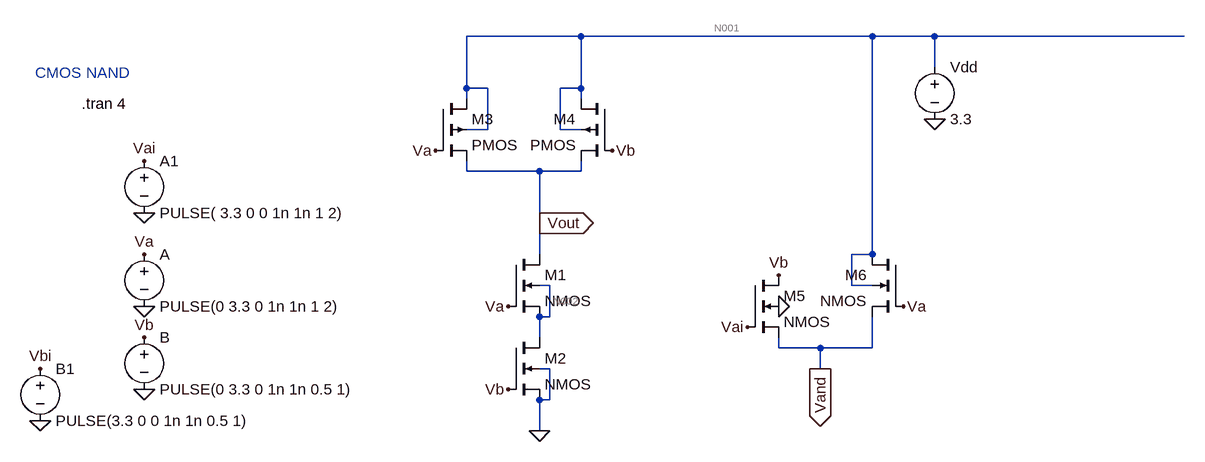
[diagram p0: schematic CMOS_NAND.asc]
CMOS_NAND.asc, the LTspice schematic file:
Version 4
SHEET 1 1540 680
WIRE 576 0 400 0
WIRE 1024 0 576 0
WIRE 1120 0 1024 0
WIRE 1504 0 1120 0
WIRE 1120 48 1120 0
WIRE 400 80 400 0
WIRE 432 80 400 80
WIRE 576 80 576 0
WIRE 576 80 544 80
WIRE 400 96 400 80
WIRE 576 96 576 80
WIRE 432 144 432 80
WIRE 432 144 400 144
WIRE 544 144 544 80
WIRE 576 144 544 144
WIRE 400 208 400 192
WIRE 512 208 400 208
WIRE 576 208 576 192
WIRE 576 208 512 208
WIRE 512 288 512 208
WIRE 512 336 512 288
WIRE 1024 336 1024 0
WIRE 1024 336 992 336
WIRE 528 384 512 384
WIRE 992 384 992 336
WIRE 1024 384 992 384
WIRE 528 432 528 384
WIRE 528 432 512 432
WIRE 512 464 512 432
WIRE 880 480 880 464
WIRE 944 480 880 480
WIRE 1024 480 1024 432
WIRE 1024 480 944 480
WIRE 528 512 512 512
WIRE 944 512 944 480
WIRE 528 560 528 512
WIRE 528 560 512 560
WIRE 512 608 512 560
FLAG -96 416 0
FLAG -96 544 0
FLAG 1120 128 0
FLAG 512 608 0
FLAG -96 336 Va
FLAG 352 176 Va
FLAG 464 416 Va
FLAG -96 464 Vb
FLAG 464 544 Vb
FLAG 624 176 Vb
FLAG 512 288 Vout
IOPIN 512 288 Out
FLAG 832 448 Vai
FLAG 880 368 Vb
FLAG 1072 416 Va
FLAG 944 512 Vand
IOPIN 944 512 Out
FLAG -96 272 0
FLAG -96 192 Vai
FLAG -256 592 0
FLAG -256 512 Vbi
FLAG 880 416 0
SYMBOL nmos4 464 336 R0
SYMATTR InstName M1
SYMBOL nmos4 464 464 R0
SYMATTR InstName M2
SYMBOL pmos4 352 96 R0
SYMATTR InstName M3
SYMBOL pmos4 624 96 M0
SYMATTR InstName M4
SYMBOL voltage -96 320 R0
WINDOW 123 0 0 Left 0
WINDOW 39 0 0 Left 0
SYMATTR InstName A
SYMATTR Value PULSE(0 3.3 0 1n 1n 1 2)
SYMBOL voltage -96 448 R0
SYMATTR InstName B
SYMATTR Value PULSE(0 3.3 0 1n 1n 0.5 1)
SYMBOL voltage 1120 32 R0
SYMATTR InstName Vdd
SYMATTR Value 3.3
SYMBOL voltage -96 176 R0
WINDOW 123 0 0 Left 0
WINDOW 39 0 0 Left 0
SYMATTR InstName A1
SYMATTR Value PULSE( 3.3 0 0 1n 1n 1 2)
SYMBOL voltage -256 496 R0
SYMATTR InstName B1
SYMATTR Value PULSE(3.3 0 0 1n 1n 0.5 1)
SYMBOL nmos4 832 368 R0
SYMATTR InstName M5
SYMBOL nmos4 1072 336 M0
SYMATTR InstName M6
TEXT -264 56 Left 2 ;CMOS NAND
TEXT -192 104 Left 2 !.tran 4

The netlist it stands for:
* CMOS_NAND.asc
M1 Vout Va N002 N002 NMOS
M2 N002 Vb 0 0 NMOS
M3 N001 Va Vout N001 PMOS
M4 N001 Vb Vout N001 PMOS
V§A Va 0 PULSE(0 3.3 0 1n 1n 1 2)
V§B Vb 0 PULSE(0 3.3 0 1n 1n 0.5 1)
Vdd N001 0 3.3
V§A1 Vai 0 PULSE( 3.3 0 0 1n 1n 1 2)
V§B1 Vbi 0 PULSE(3.3 0 0 1n 1n 0.5 1)
M5 Vb Vai Vand 0 NMOS
M6 N001 Va Vand N001 NMOS
.model NMOS NMOS
.model PMOS PMOS
.lib standard.mos
* CMOS NAND
.tran 4
.backanno
.end

* Results of the author's LTspice run, read from the files saved beside the schematic
* Operating Point, zero values left out:
*   V(vout) = 3.3 V
*   V(n002) = 1.65 V
*   V(n001) = 3.3 V
*   V(vai) = 3.3 V
*   V(vbi) = 3.3 V
*   V(vand) = 2.703 V
*   Id(M4) = 1.655 pA
*   Is(M4) = -1.655 pA
*   Id(M3) = 1.655 pA
*   Is(M3) = -1.655 pA
*   Ib(M6) = 105.4 µA
*   Is(M6) = -105.4 µA
*   Id(M5) = -105.3 µA
*   Ib(M5) = -2.713 pA
*   Is(M5) = 105.3 µA
*   Id(M2) = 3.31 pA
*   Ib(M2) = -1.66 pA
*   Is(M2) = -1.65 pA
*   Id(M1) = 3.31 pA
*   Ib(M1) = -1.66 pA
*   Is(M1) = -1.65 pA
*   I(Vdd) = -105.3 µA
*   I(B) = 105.3 µA
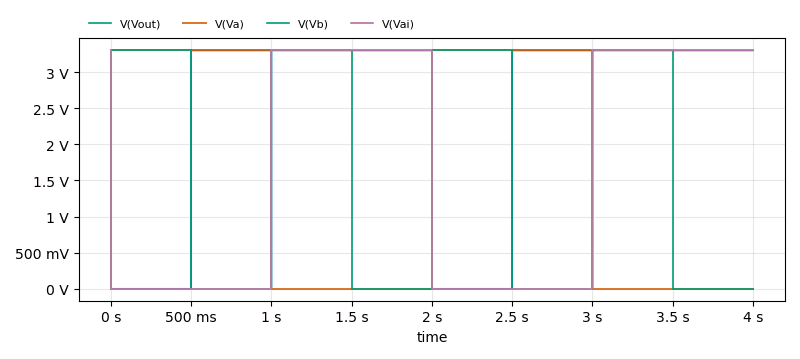
[diagram p1: Transient Analysis of CMOS_NAND.asc, plotted from the saved traces]
* Transient Analysis, 1 run:
*   V(Vout): min 399 nV, max 3.301 V, average 2.475 V, rms 2.858 V, last 3.3 V
*   V(Va): min 0 V, max 3.3 V, average 1.65 V, rms 2.333 V, last 0 V
*   V(Vb): min 0 V, max 3.3 V, average 1.65 V, rms 2.333 V, last 0 V
*   V(Vai): min 0 V, max 3.3 V, average 1.65 V, rms 2.333 V, last 3.3 V